# EAGLE design esp8266_ver3 (EAGLE 8.2.2)
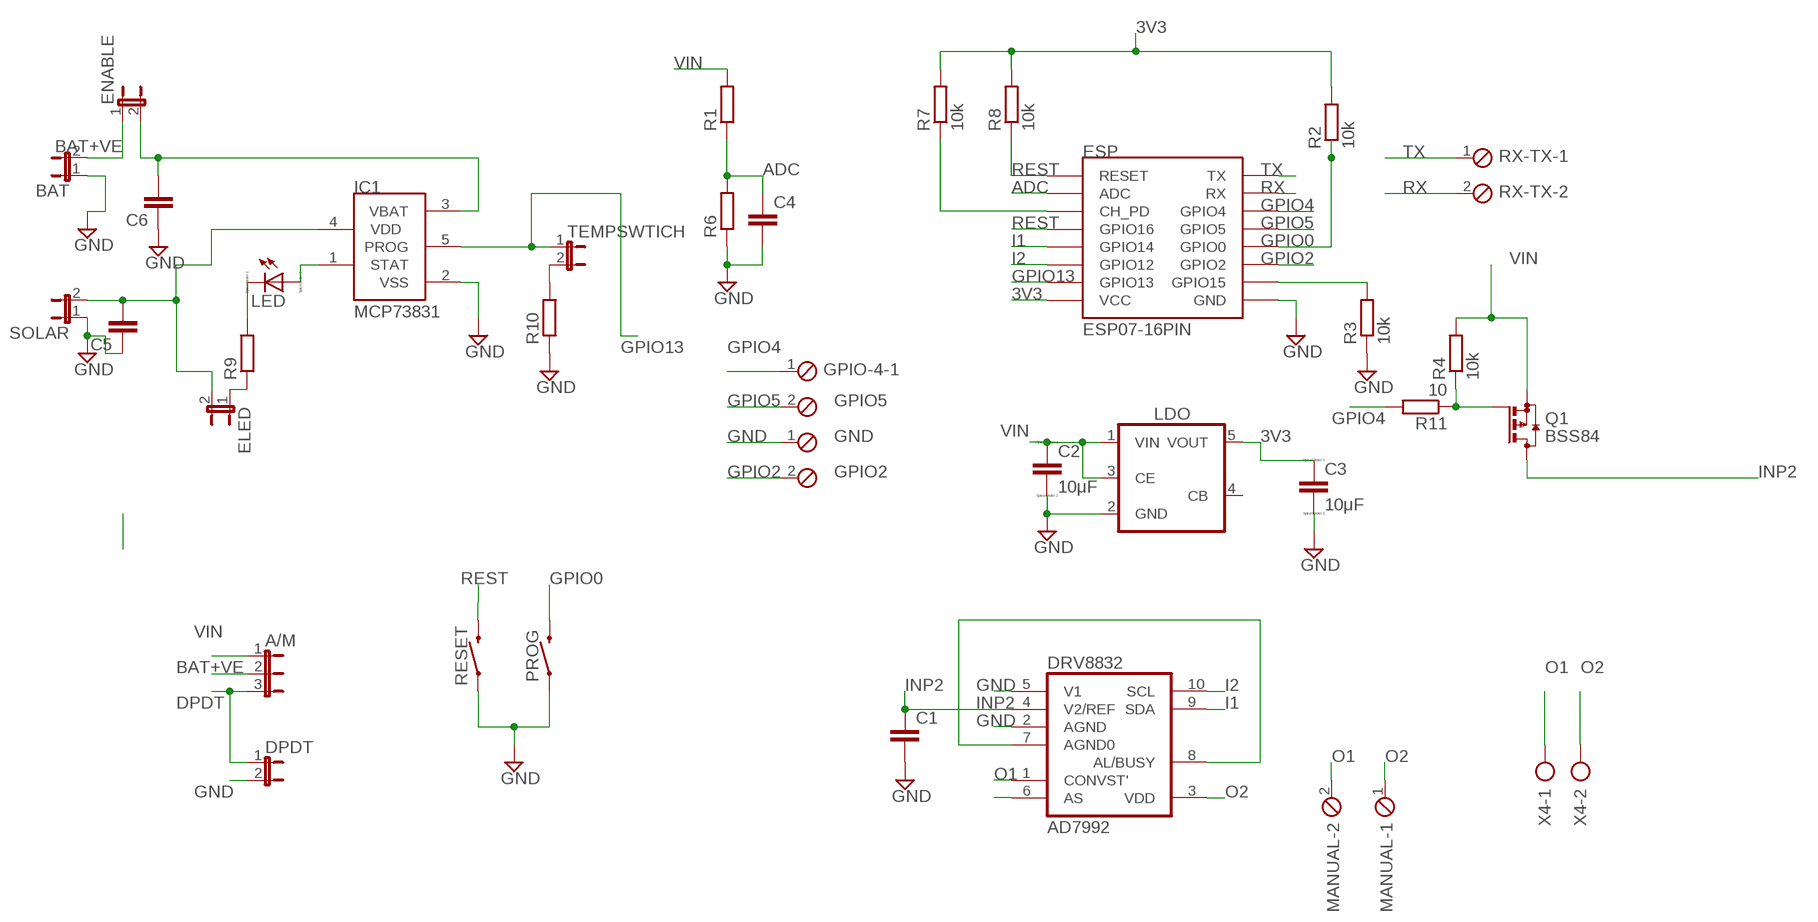
[diagram p0: schematic, sheet 1]

## Parts
A/M  JP2E  [JP2]
BAT  JP1E  [JP1]
C1  C-EUC0805K  [C0805K]
C2  10μF  CC1206  [C1206]
C3  10μF  CC1206  [C1206]
C4  C-EUC1206  [C1206]
C5  C-EUC1206  [C1206]
C6  C-EUC1206  [C1206]
DPDT  JP1E  [JP1]
DRV8832  AD7992  [MSOP10]
ELED  JP1E  [JP1]
ENABLE  JP1E  [JP1]
ESP  ESP07-16PIN  [ESP07-16PIN]
GPIO-4  MPT2  [2POL254]
IC1  MCP73831  [SOT23-5L]
LDO  TS5205  [SOT25]
LED  LED_E  [LED_1206]
MANUAL  MPT2  [2POL254]
PROG  MOMENTARY-SWITCH-SPST-SMD-5.2MM  [TACTILE_SWITCH_SMD_5.2MM]
Q1  BSS84  [SOT23]
R1  R-EU_R1206  [R1206]
R2  10k  R-EU_R1206  [R1206]
R3  10k  R-EU_R1206  [R1206]
R4  10k  R-EU_R1206  [R1206]
R6  R-EU_R1206  [R1206]
R7  10k  R-EU_R1206  [R1206]
R8  10k  R-EU_R1206  [R1206]
R9  R-EU_R1206  [R1206]
R10  R-EU_R1206  [R1206]
R11  10  R-EU_R1206  [R1206]
RESET  MOMENTARY-SWITCH-SPST-SMD-5.2MM  [TACTILE_SWITCH_SMD_5.2MM]
RX-TX  MPT2  [2POL254]
SOLAR  JP1E  [JP1]
TEMPSWTICH  JP1E  [JP1]
X2  MPT2  [2POL254]
X4  AK300/2  [AK300/2]

## Nets
3V3: C3.1 ESP.VCC LDO.5(VOUT) R2.2 R7.2 R8.2
ADC: C4.1 ESP.ADC R1.1 R6.2
B: C6.2 ENABLE.2 IC1.3(VBAT)
BAT+VE: A/M.2 BAT.2 ENABLE.1
DPDT: A/M.3 DPDT.1
GND: BAT.1 C1.2 C2.2 C3.2 C4.2 C5.1 C6.1 DPDT.2 DRV8832.2(AGND) DRV8832.5(V1) ESP.GND IC1.2(VSS) LDO.2(GND) PROG.1 R3.1 R6.1 R10.1 RESET.1 SOLAR.1 X2.1
GPIO0: ESP.GPIO0 PROG.3 R2.1
GPIO2: ESP.GPIO2 X2.2
GPIO4: ESP.GPIO4 GPIO-4.1 R11.2
GPIO5: ESP.GPIO5 GPIO-4.2
GPIO13: ESP.GPIO13 IC1.5(PROG) TEMPSWTICH.1
I1: DRV8832.9(SDA) ESP.GPIO14
I2: DRV8832.10(SCL) ESP.GPIO12
INP2: C1.1 DRV8832.4(V2/REF) Q1.3(D)
N$1: IC1.1(STAT) LED.A
N$3: DRV8832.7(AGND0) DRV8832.8(AL/BUSY)
N$4: R10.2 TEMPSWTICH.2
N$5: LED.C R9.2
N$6: ELED.1 R9.1
N$8: Q1.1(G) R4.1 R11.1
N$11: C5.2 ELED.2 IC1.4(VDD) SOLAR.2
N$12: DRV8832.6(AS)
N$32: ESP.CH_PD R7.1
N$44: ESP.GPIO15 R3.2
O1: DRV8832.1(CONVST') MANUAL.2 X4.1
O2: DRV8832.3(VDD) MANUAL.1 X4.2
REST: ESP.GPIO16 ESP.REST(RESET) R8.1 RESET.3
RX: ESP.RX RX-TX.2
TX: ESP.TX RX-TX.1
VIN: A/M.1 C2.1 LDO.1(VIN) LDO.3(CE) Q1.2(S) R1.2 R4.2
Unconnected: LDO.4(CB)

## Notes on the sheet
- GPIO5
- GND
- GPIO2

## Library data of the parts
A/M = jumper:JP2E: JUMPER
BAT DPDT ELED ENABLE SOLAR TEMPSWTICH = jumper:JP1E: JUMPER
C1 C4-C6 = rcl:C-EU: CAPACITOR, European symbol
C2 C3 = eagle-ltspice:C: CAPACITOR, European symbol; SPICEMODEL: NONE; SPICEPREFIX: C
DRV8832 = analog_devices_gaui:AD7992: 16-Bit DAC with Serial Data Interface
ESP = esp8266modules:ESP07-16PIN
GPIO-4 MANUAL RX-TX X2 = con-phoenix-254:MPT2: PHOENIX CONNECTOR; OC_FARNELL: unknown; OC_NEWARK: unknown
IC1 = microchip-update:MCP73831: Miniature Single-Cell, Fully Integrated Li-Ion, Li-Polymer Charge Management Controllers
LDO = v-reg:TS5205: 150mA Low Noise LDO Voltage Regulator with Enable TSC [Taiwan Semiconductor Company, Ltd] Source: http://www.taiwansemi.com .. 5205_0409c.pdf
LED = eagle-ltspice:LED_E: LED Source: http://www.osram.convergy.de Source: www.luxeon.com Source: www.kingbright.com; SPICEMODEL: NONE; SPICEPREFIX: D; SPICETYPE: diode
PROG RESET = SparkFun-Switches:MOMENTARY-SWITCH-SPST: Momentary Switch (Pushbutton) - SPST Normally-open (NO) SPST momentary switches (buttons, pushbuttons). Variants PTH-12MM - 12mm square, through-hole Momentary Pushbutton Switch - 12mm Square <https://www.sparkfun.com/products/9190> (COM-09190) PTH-6.0MM, PTH-6.0MM-KIT - 6.0mm square, through-hole Mini Pushbutton Switch <https://www.sparkfun.com/products/97> (COM-00097) KIT package intended for soldering kit's - only one side of pads' copper is exposed. PTH-RIGHT-ANGLE-KIT - Right-angle, through-hole Right Angle Tactile Button <https://www.sparkfun.com/products/10791> - Used on SparkFun BigTime Watch Kit <https://www.sparkfun.com/products/11734> SMD-12MM - 12mm square, surface-mount Tactile Button - SMD (12mm) <https://www.sparkfun.com/products/12993> (COM-12993) Used on SparkFun PicoBoard <https://www.sparkfun.com/products/11888> SMD-4.5MM - 4.5mm Square Trackball Switch Used on SparkFun Blackberry Trackballer Breakout <https://www.sparkfun.com/products/13169> SMD-4.6MMX2.8MM - 4.60mm x 2.80mm, surface mount Used on SparkFun SAMD21 Mini Breakout <https://www.sparkfun.com/products/13664> SMD-5.2MM, SMD-5.2-REDUNDANT - 5.2mm square, surface-mount Mini Pushbutton Switch - SMD <https://www.sparkfun.com/products/8720> (COM-08720) Used on Arduino Pro Mini <https://www.sparkfun.com/products/11114> REDUNDANT package connects both switch circuits together SMD-6.0X3.5MM - 6.0 x 3.5mm, surface mount Momentary Reset Switch SMD <https://www.sparkfun.com/products/8229> (COM-08229) SMD-6.2MM-TALL - 6.2mm square, surface mount Tactile Button - SMD (6mm) <https://www.sparkfun.com/products/12992> Used on SparkFun Digital Sandbox <https://www.sparkfun.com/products/12651> SMD-RIGHT-ANGLE - Right-angle, surface mount Used on SparkFun Block for Intel® Edison - Arduino <https://www.sparkfun.com/products/13036>; PROD_ID: SWCH-08247; SF_SKU: COM-08720
Q1 = transistor-small-signal:BSS84: P-CHANNEL MOS FET
R1 R4 R6 R9-R11 = resistor:R-EU_: RESISTOR, European symbol
R2 R3 R7 R8 = rcl:R-EU_: RESISTOR, European symbol
X4 = con-ptr500:AK300/2: CONNECTOR; OC_FARNELL: unknown; OC_NEWARK: unknown

## Net classes
0 default: width 0.508 mm

## Board
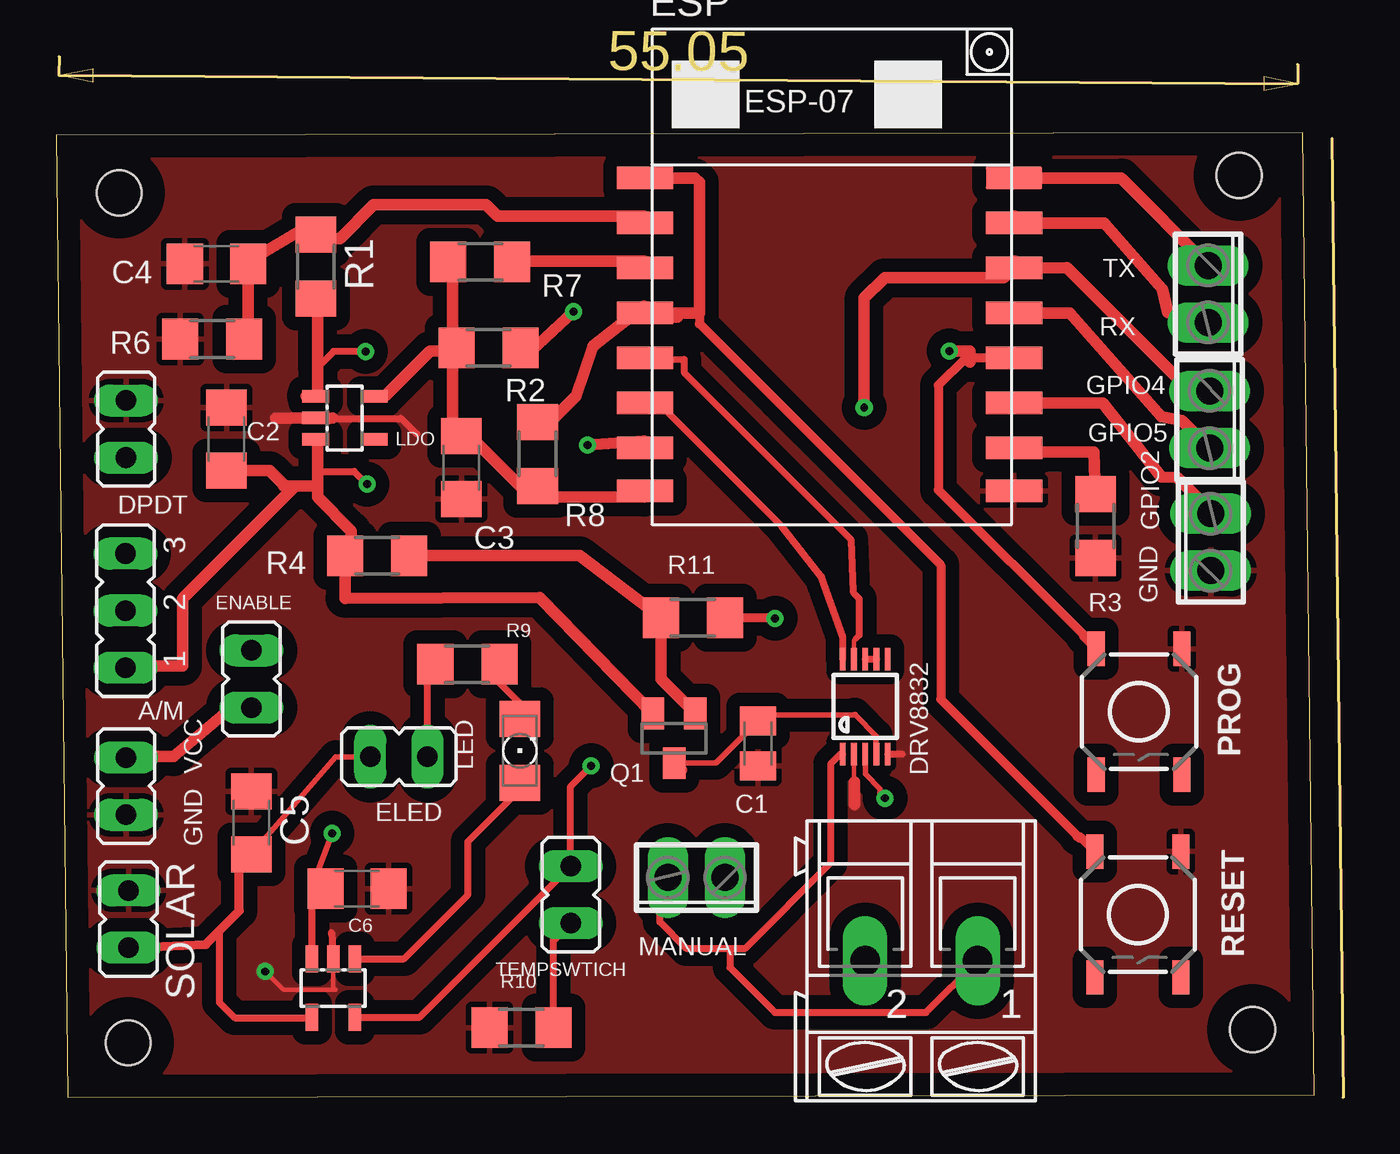
[diagram p1: board, top side]
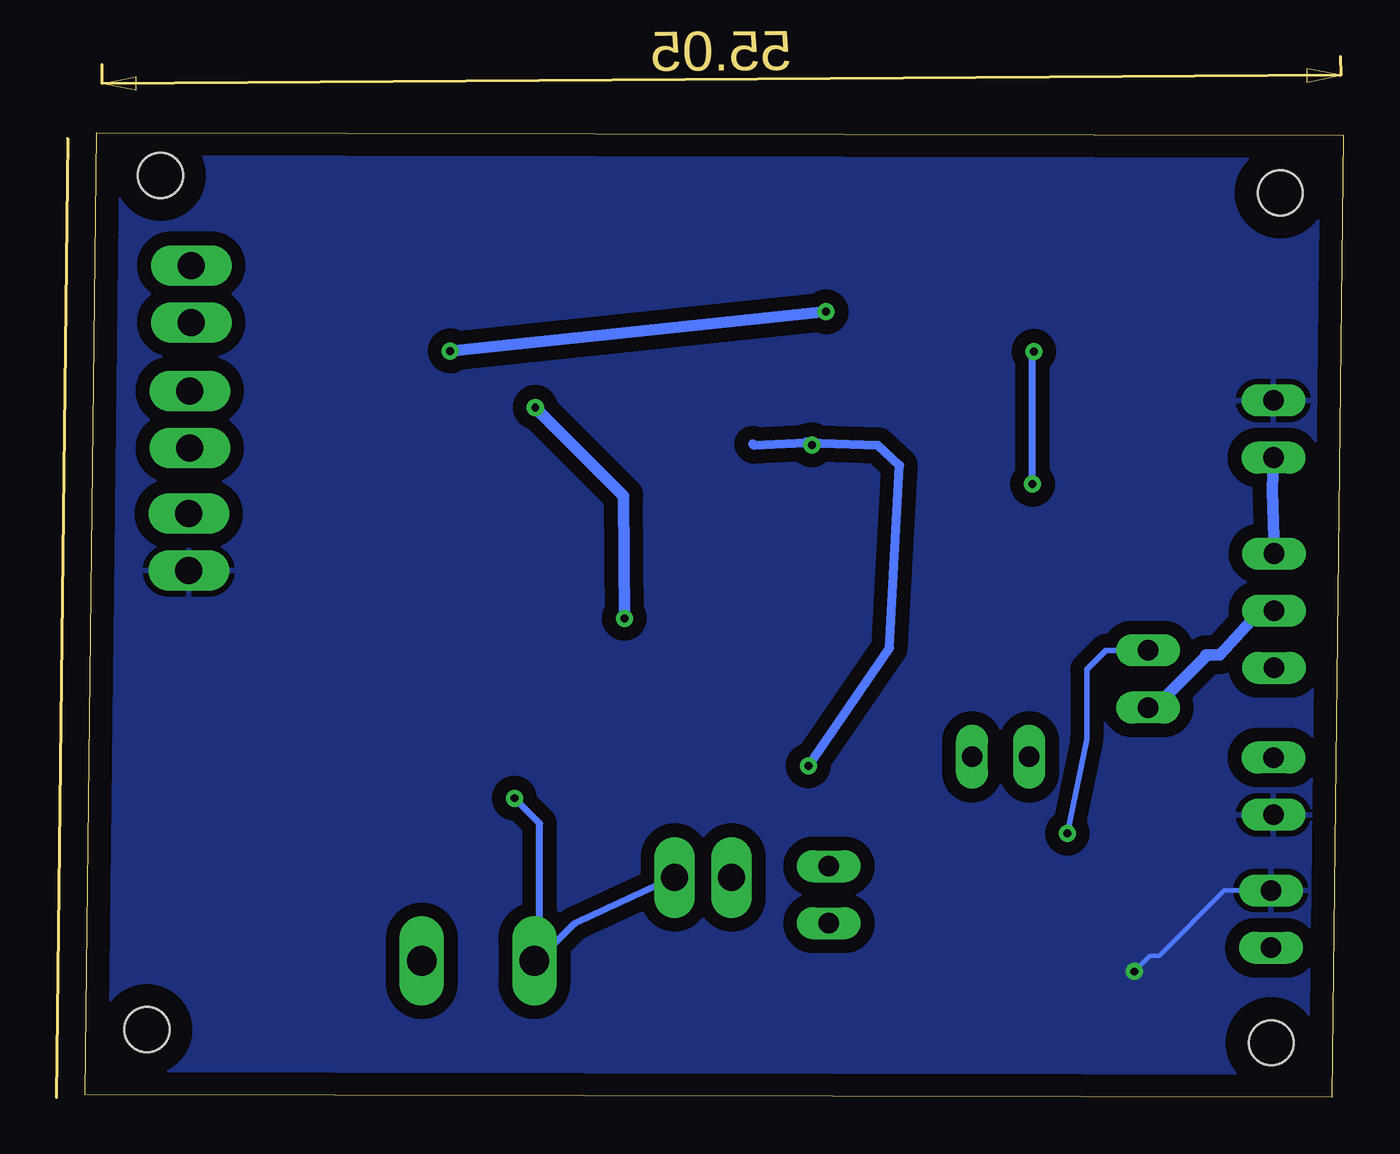
[diagram p2: board, bottom side, seen from below]

Size 55.9 x 42.88 mm. Coordinates in mm from the lower left corner, seen from the top.
Outline: 0.51,0 55.9,0.12 55.39,42.88 0,42.76 0.51,0
Copper layers (1*16): Top 0.035mm / dielectric 1.5mm / Bottom 0.035mm
Design rules "default": minimum track width 6mil, minimum drill 0.35mm, track to track 6mil, track to pad 6mil, pad to pad 6mil, via to via 6mil, smd to smd 6mil, copper to edge 40mil, drill to drill 6mil, minimum pad ring 10mil, minimum via ring 8mil, stop-mask expansion 4mil, vias tented up to drill 0mil, thermal gap 10mil
Holes 2 mm at 2.8,40.2 52.57,40.97 53.17,3.01 3.2,2.42

### Footprints (pad centres in the part's own frame; a part is rotated, then mirrored left to right if it is on the bottom)
JP2 = drill 0.914 long: 1 -2.54,0; 2 0,0; 3 2.54,0
JP1 = drill 0.914 long: 1 0,-1.27; 2 0,1.27
C0805K = smd 1.3 x 1.6: 1 -1,0; 2 1,0
C1206 = smd 1.6 x 1.8: 1 -1.4,0; 2 1.4,0
MSOP10 = smd 0.25 x 1: 1 -1,-2.113; 2 -0.5,-2.113; 3 0,-2.113; 4 0.5,-2.113; 5 1,-2.113; 6 1,2.113; 7 0.5,2.113; 8 0,2.113; 9 -0.5,2.113; 10 -1,2.113
ESP07-16PIN = smd 2.5 x 1: ADC -8.2,3.8; CH_PD -8.2,1.8; GND 8.2,-8.105; GPIO0 8.2,-2.2; GPIO2 8.2,-4.2; GPIO4 8.2,1.8; GPIO5 8.2,-0.2; GPIO12 -8.2,-4.2; GPIO13 -8.2,-6.2; GPIO14 -8.2,-2.2; GPIO15 8.2,-6.2; GPIO16 -8.2,-0.2; REST -8.2,5.8; RX 8.2,3.8; TX 8.2,5.8; VCC -8.2,-8.105
2POL254 = drill 1.2 long: 1 -1.27,0; 2 1.27,0
SOT23-5L = smd 0.55 x 1.2: 1 -0.95,-1.3; 2 0,-1.3; 3 0.95,-1.3; 4 0.95,1.3; 5 -0.95,1.3
SOT25 = smd 0.55 x 1.2: 1 -0.95,-1.3; 2 0,-1.3; 3 0.95,-1.3; 4 0.95,1.3; 5 -0.95,1.3
LED_1206 = smd 1.6 x 1.803: A -1.422,0; C 1.422,0
TACTILE_SWITCH_SMD_5.2MM = smd 1.524 x 0.762: 1 -2.794,1.905; 2 2.794,1.905; 3 -2.794,-1.905; 4 2.794,-1.905
SOT23 = smd 1 x 1.4: 1 -0.95,-1.1; 2 0.95,-1.1; 3 0,1.1
R1206 = smd 1.6 x 1.803: 1 -1.422,0; 2 1.422,0
AK300/2 = drill 1.321 long: 1 -2.515,0; 2 2.489,0

### Placement (x,y rotation side)
A/M  3.07,21.63 90 top
BAT  3.11,13.83 0 top
C1  31.18,15.73 270 top
C2  7.57,29.25 90 top
C3  18.01,27.98 270 top
C4  7.12,37.05 180 top
C5  8.67,12.2 270 top
C6  13.36,9.27 180 top
DPDT  3.1,29.7 0 top
DRV8832  35.95,17.37 0 top
ELED  15.23,15.14 90 top
ENABLE  8.67,18.59 0 top
ESP  34.37,35.06 0 top
GPIO-4  51.26,30.12 270 top
IC1  12.31,4.86 180 top
LDO  12.82,30.2 270 top
LED  20.61,15.4 90 top
MANUAL  28.45,9.77 180 top
PROG  48.11,17.14 270 top
Q1  27.46,15.96 180 top
R1  11.54,36.91 270 top
R2  19.21,33.3 180 top
R3  46.19,25.39 90 top
R4  14.25,24.07 180 top
R6  6.94,33.7 0 top
R7  18.84,37.12 180 top
R8  21.39,28.6 270 top
R9  18.27,19.26 0 top
R10  20.67,3.1 0 top
R11  28.29,21.32 0 top
RESET  48.07,8.13 270 top
RX-TX  51.19,35.7 270 top
SOLAR  3.21,7.92 180 top
TEMPSWTICH  22.86,9 180 top
X2  51.31,24.67 90 top
X4  38.44,6.07 180 top

### Tracks (layer width: path | path; a pad name or v marks a point on that pad's centre or on a via)
3V3
  Top 0.508: ESP.VCC 26.11,26.67 21.61,26.67 R8.2 21.11,26.67 18.11,29.67 C3.1 17.61,29.67 17.61,33.17 | 17.61,33.17 16.61,33.17 14.61,31.17 LDO.5 | 17.61,33.17 R2.2 17.61,33.67 17.61,36.67 R7.2
ADC
  Top 0.508: R6.2 8.52,34.15 8.52,36.65 C4.1 8.52,37.15 11.11,38.67 R1.1 11.61,38.17 12.61,38.17 14.11,39.67 19.11,39.67 19.61,39.17 26.11,39.17 ESP.ADC
B  (via drill 0.35)
  Top 0.254: v12.26,11.73 11.5,9.73 C6.2
  Top 0.305: 11.37,9.72 C6.2 11.37,9.31 IC1.3
  Bottom 0.254: ENABLE.2 10.54,19.86 11.4,19 11.4,15.91 v12.26,11.73
BAT+VE
  Top 0.254: ENABLE.1 8.67,17.23 8.61,17.17
  Top 0.508: 8.61,17.17 7.61,17.17 5.21,15.14 3.21,15.14 BAT.2
  Bottom 0.254: ENABLE.1 8.67,17.15 8.61,17.09
  Bottom 0.508: A/M.2 3.61,21.7 5.5,19.67 6.11,19.67 6.11,19.59 8.61,17.09
DPDT
  Bottom 0.508: A/M.3 3.16,26.97 DPDT.1
GND  (via drill 0.35)
  Top 0.203: DRV8832.2 35.45,14.04 35.47,14.03 | IC1.2 12.31,4.88 12.42,4.78 10.1,4.78 v9.29,5.59 9.14,5.74
  Top 0.305: DRV8832.5 37.59,15.25 | 12.11,30.17 15.32,30.17 16.02,29.48 | IC1.2 12.23,7.32 12.23,7.33 12.23,7.27 12.24,7.27
  Top 0.406: C5.1 8.66,14.17 8.77,14.06 9.19,14.06 9.12,13.99
  Top 0.508: 11.61,30.17 12.11,30.17 12.28,30.2 | 11.61,30.17 LDO.2 | 35.47,14.03 35.47,14.02 35.47,13.02 | C3.2 18.11,26.67 18.09,26.67 | 9.77,30.2 9.76,30.19 11.59,30.19 11.61,30.17
  Bottom 0.203: SOLAR.1 5.27,9.19 8.17,6.29 8.59,6.29 v9.29,5.59
  pour Top (isolate 0.61): -0.7,40.94 -0.45,-4.17 2.07,-4.69 51.56,-5.04 59.53,-4.22 60.38,43.64 5.82,43.26 -0.52,43.26
  pour Bottom (isolate 0.61): -0.01,-6.37 0.4,-6.78 58.66,-6.78 62.28,-5.57 62.42,37.49 59.59,43.75 0.93,43.75
GPIO0  (via drill 0.35)
  Top 0.406: ESP.GPIO0 40.61,32.86 40.42,32.86 39.2,31.64 39.2,27 45.66,20.55 45.66,20.48 PROG.3
  Top 0.508: v22.99,34.91 21.11,33.17 R2.1 | v39.69,33.17 40.61,33.17 40.61,32.86 40.61,32.67
  Bottom 0.508: v39.69,33.17 v22.99,34.91
GPIO2
  Top 0.508: 51.15,26.21 49.82,27.55 49.12,27.58 46.5,30.86 ESP.GPIO2 | 51.15,26.21 51.83,25.54 | X2.2 51.11,26.17 51.15,26.21
GPIO4  (via drill 0.35)
  Top 0.406: R11.2 31.91,21.32 v31.94,21.28
  Top 0.508: ESP.GPIO4 42.61,37.17 | ESP.GPIO4 44.92,36.87 50.73,31.06 51.02,31.46 | 51.02,31.46 51.52,31.45 | 29.72,21.08 R11.2 | v35.9,30.66 35.9,35.51 36.82,36.42 42.12,36.42 ESP.GPIO4 | GPIO-4.1 51.11,31.17 51.02,31.46
  Bottom 0.508: v31.94,21.28 31.97,26.73 35.97,30.73 | 35.97,30.73 | 35.97,30.73 v35.9,30.66
GPIO5
  Top 0.508: GPIO-4.2 50.02,30.09 49.12,30.26 45.04,34.86 ESP.GPIO5
GPIO13  (via drill 0.35)
  Top 0.305: IC1.5 16.15,3.56 TEMPSWTICH.1 22.86,13.82 v23.77,14.73
  Top 0.508: v23.61,28.99 26.11,29.17 ESP.GPIO13
  Bottom 0.406: v23.77,14.73 20.16,19.98 19.71,28.08 20.68,28.97 23.86,29.07 26.18,28.97 26.25,29.04
  Bottom 0.508: v23.61,28.99 23.86,29.07
I1
  Top 0.203: DRV8832.9 35.45,20.3 35.52,20.37
  Top 0.254: 35.52,20.37 35.69,20.55
  Top 0.305: ESP.GPIO14 27.9,32.79 27.9,32.21 35.31,24.8 35.41,22.47 35.52,22.32 35.69,22.15 35.69,20.55
I2
  Top 0.305: DRV8832.10 34.95,20.47 34.01,23.13 32.25,25.37 26.72,30.9 26.2,30.9 ESP.GPIO12
INP2
  Top 0.254: Q1.3 29.31,14.86 C1.1 31.45,17 35.51,17 | 35.51,17 35.48,17.02 | 35.51,17 36.44,16.07 DRV8832.4
  Top 0.508: 27.79,14.54 Q1.3
N$1
  Top 0.305: IC1.1 15.46,6.16 18.3,9 18.3,11.37 20.61,13.68 LED.A
N$3
  Top 0.305: DRV8832.8 DRV8832.7
N$4
  Top 0.305: R10.2 22.09,6.96 TEMPSWTICH.2
N$5
  Top 0.305: R9.2 19.69,18.43 21.24,16.88 20.66,16.88 LED.C
N$6
  Top 0.305: ELED.1 16.5,18.91 R9.1
N$8
  Top 0.508: 16.11,23.67 R4.1 23.25,24.07 R11.1 26.87,18.59 Q1.1
N$11
  Top 0.254: C5.2 12.42,15.14 ELED.2
  Top 0.305: 7.25,7.4 7.25,4.22 7.93,3.54 11.35,3.54 IC1.4
  Top 0.406: SOLAR.2 6.64,6.79 7.25,7.4 8.14,8.29 8.14,10.86 C5.2
N$32
  Top 0.508: R7.1 20.61,37.17 26.11,37.17 ESP.CH_PD
N$44
  Top 0.508: R3.2 46.11,28.67 42.61,28.67 ESP.GPIO15
O1
  Top 0.305: DRV8832.1 34.85,15.25 34.41,14.82 34.41,10.42 30.6,6.61 29.94,6.61 | 29.94,6.61 28.01,6.61 26.82,7.8 26.82,9.41 MANUAL.2 | 29.94,6.61 29.94,5.77 31.93,3.77 38.66,3.77 X4.1
O2  (via drill 0.35)
  Top 0.254: DRV8832.3 35.95,14.36 36.61,13.7 36.61,13.51 v36.83,13.3
  Bottom 0.305: 35.7,6.17 X4.2 | 35.7,6.17 35.7,12.17 v36.83,13.3 | MANUAL.1 34.17,7.7 35.7,6.17
REST
  Top 0.406: 28.58,34.86 28.58,34.39 39.31,23.65 39.31,17.68 45.48,11.51 | 45.48,11.51 45.48,11.59 45.37,11.59 | 45.48,11.51 45.57,11.51 RESET.3
  Top 0.508: R8.1 21.61,29.67 23.11,31.17 23.86,33.4 26.11,35.17 ESP.GPIO16 | 27.61,34.67 26.61,34.67 ESP.GPIO16 | 27.11,40.67 26.61,40.67 ESP.REST 28.38,40.85 28.58,40.66 28.58,34.86 ESP.GPIO16
RX
  Top 0.508: 42.61,39.17 ESP.RX 46.59,38.86 49.16,35.93 49.39,34.88 RX-TX.2
TX
  Top 0.508: 42.61,40.67 ESP.TX 47.33,40.86 RX-TX.1 50.8,37.13
VIN  (via drill 0.35)
  Top 0.152: LDO.3 11.53,29.25 11.61,29.17
  Top 0.305: 11.61,27.82 13.24,27.82 v13.81,27.25 | v13.75,33.14 12.32,33.14 11.61,32.44
  Top 0.508: R1.2 11.61,35.17 11.61,32.44 11.61,31.17 LDO.1 11.11,31.17 | 11.61,27.17 11.61,26.67 13.11,25.17 13.11,24.17 R4.2 | 11.61,29.17 11.61,27.82 11.61,27.17 | 11.61,27.17 10.61,27.17 | 10.17,27.17 10.61,27.17 | 10.17,27.17 10.11,27.17 | 8.11,28.17 C2.1 9.48,27.85 10.17,27.17 | 10.61,27.17 5.61,22.17 5.61,19.17 3.51,19.17 A/M.1 | R4.2 13.4,24.07 | Q1.2 21.49,22.21 12.83,22.17 R4.2
  Bottom 0.305: v13.81,27.25 13.81,33.08 v13.75,33.14

### Text on the board
tNames: TX | RX | GPIO4 | GPIO5 | GPIO2 | GND | VCC | GND